# EAGLE schematic board (EAGLE 6.4)
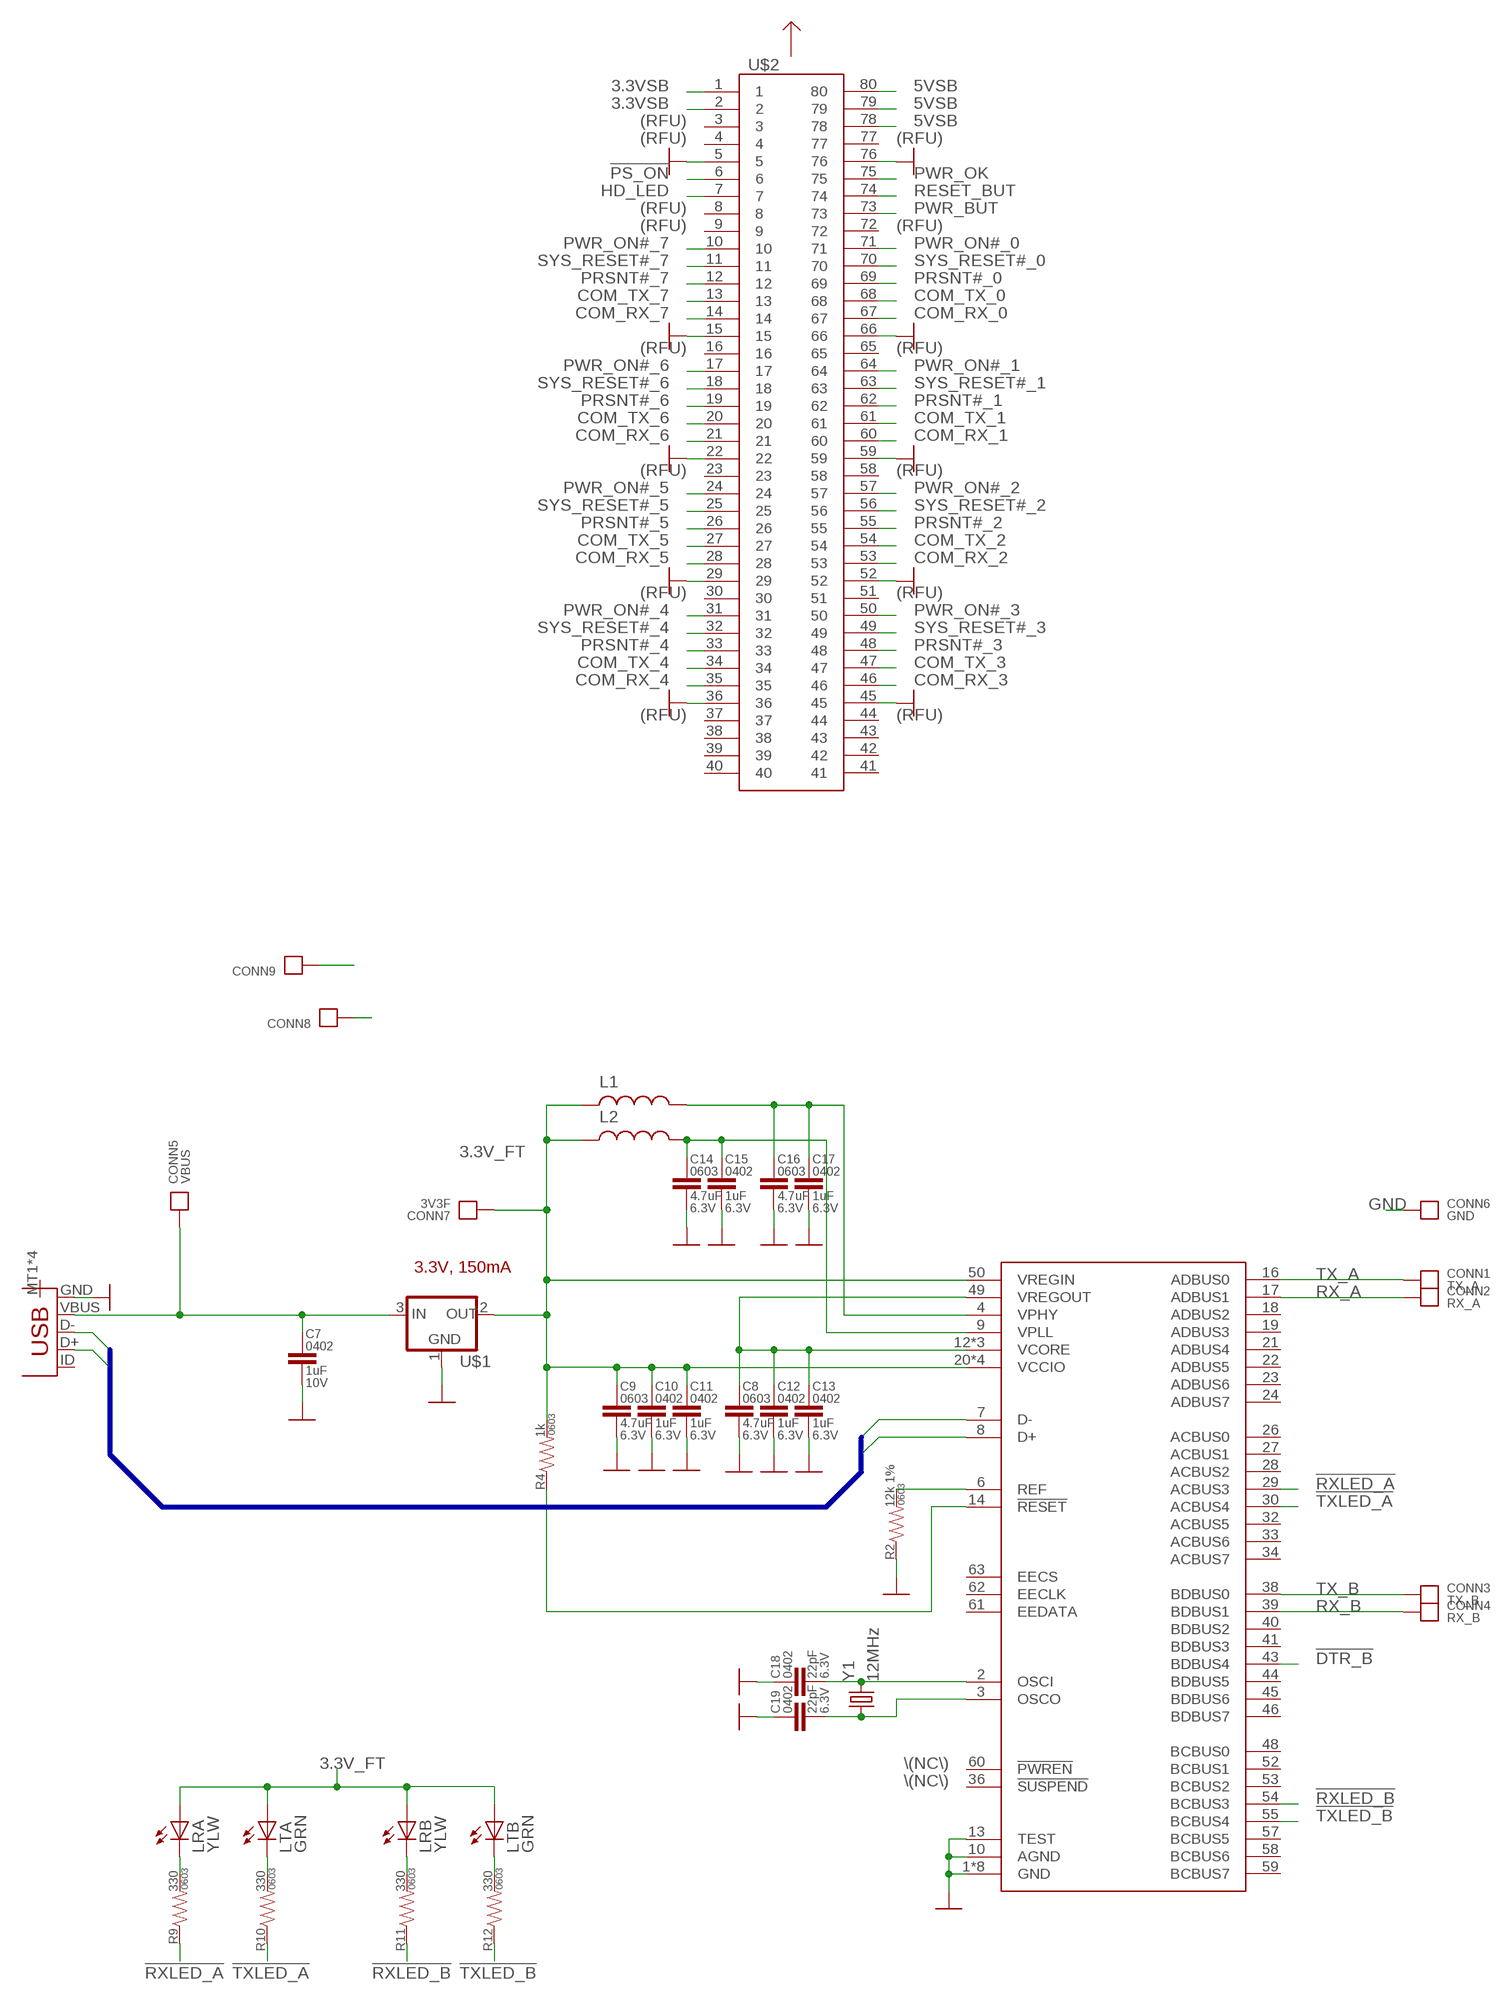
[diagram p0: schematic, sheet 1, part 1 of 2]
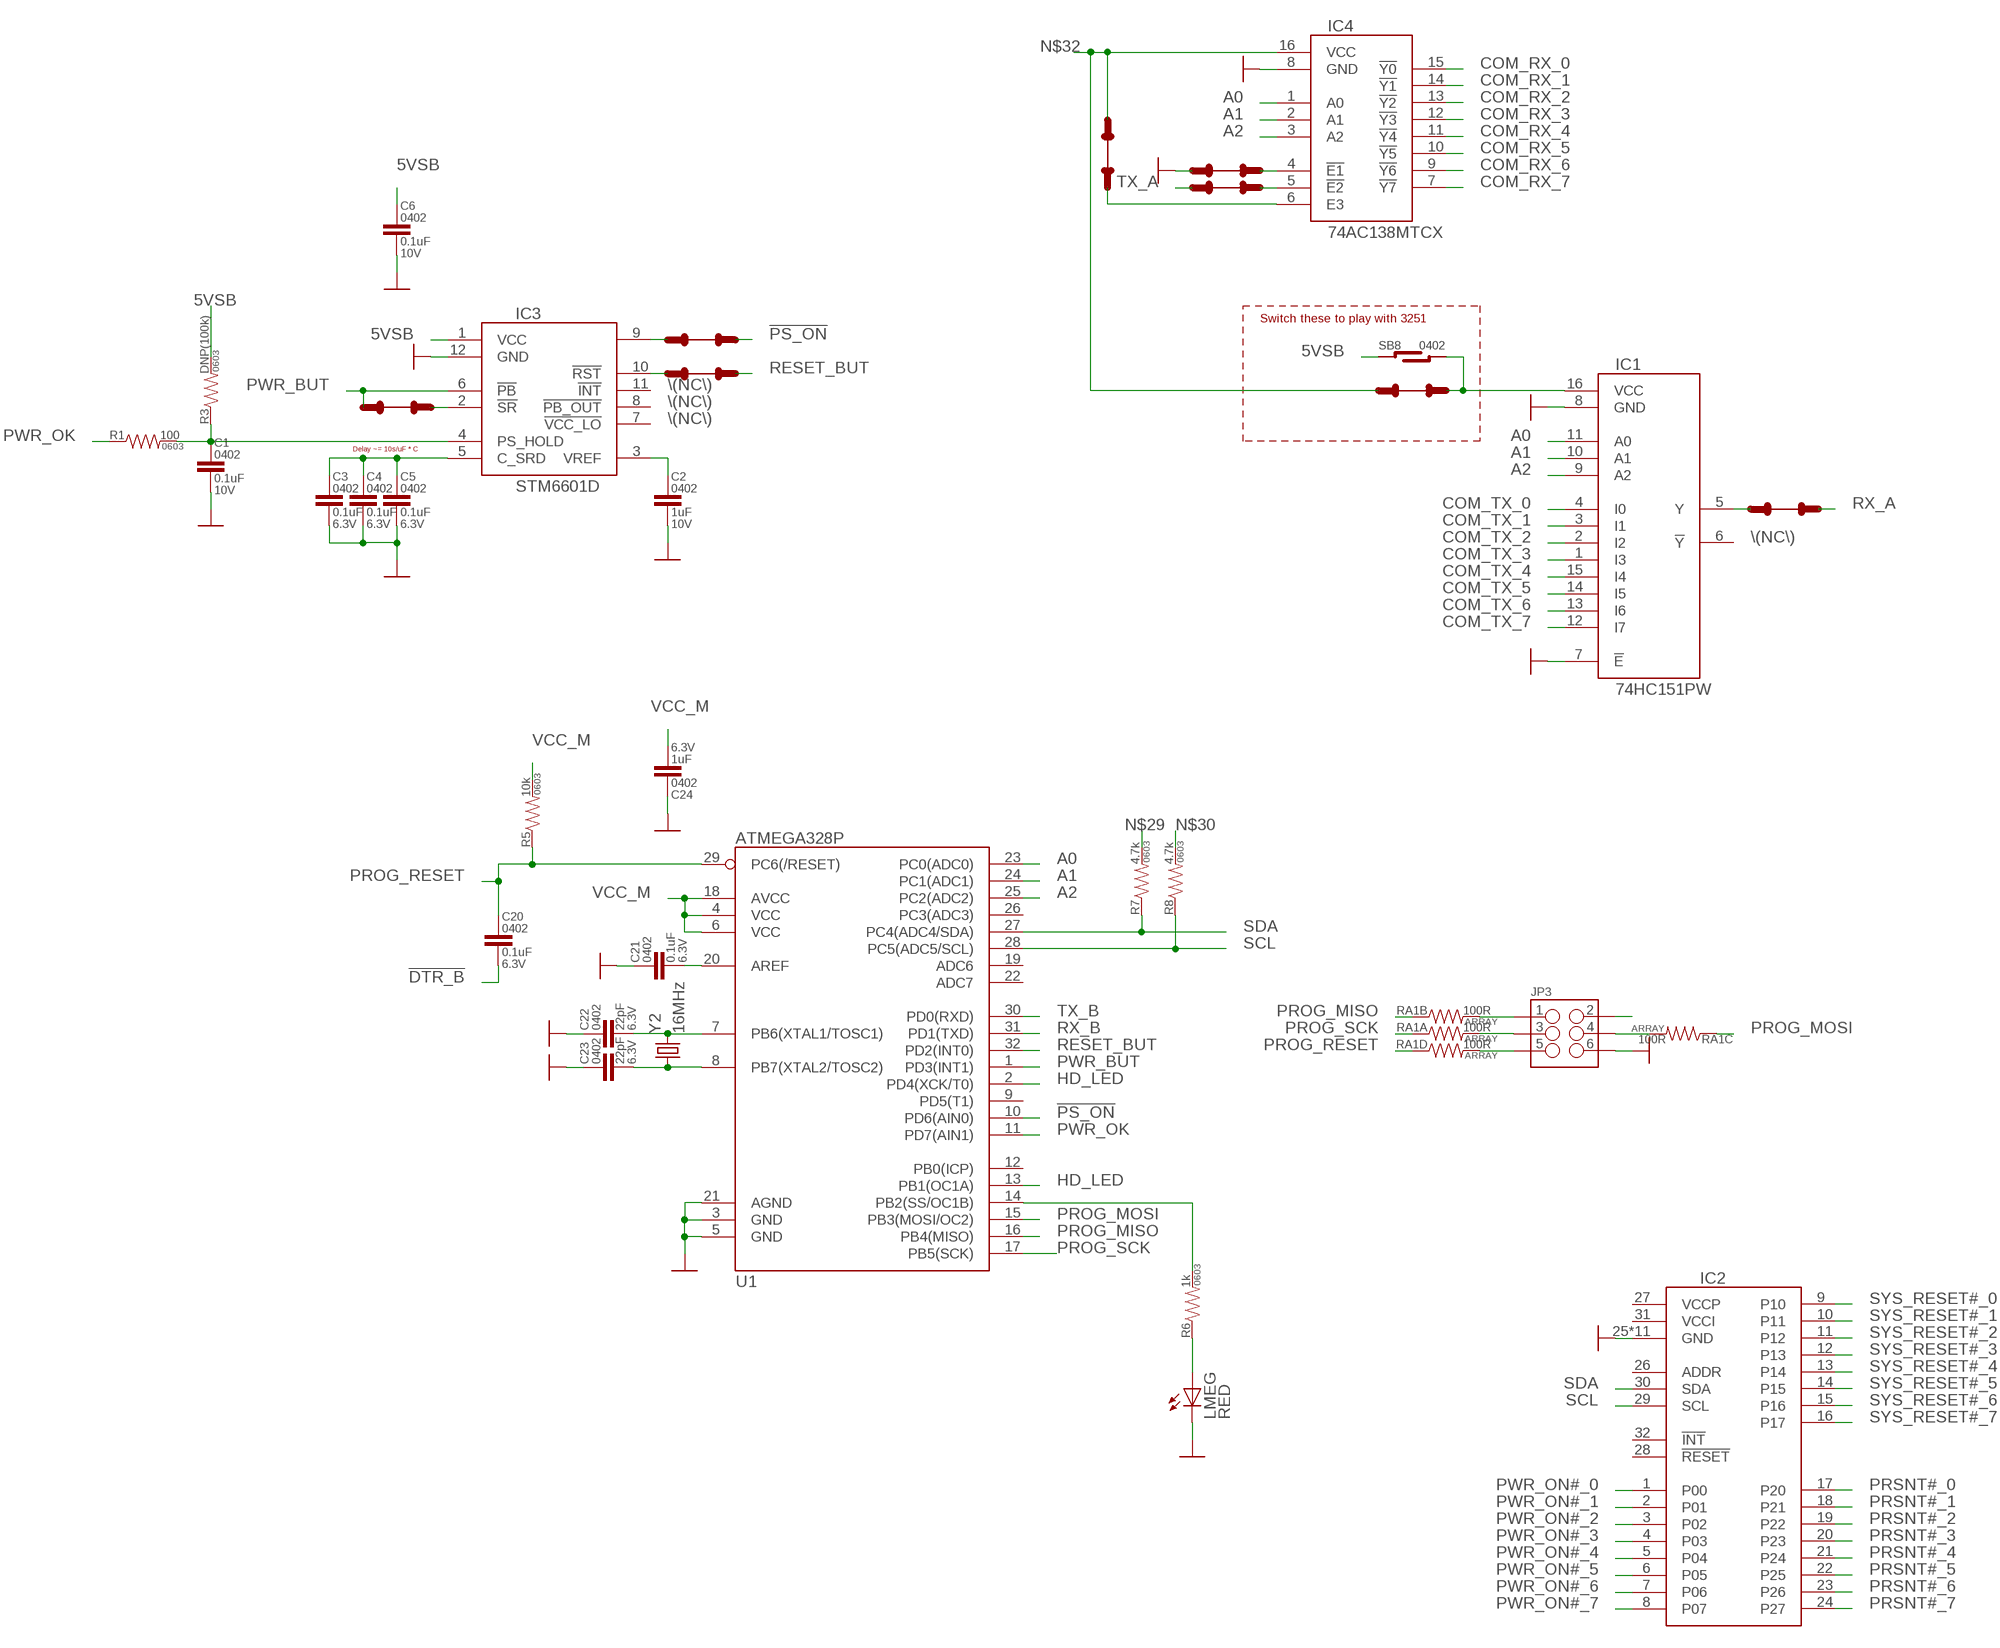
[diagram p1: schematic, sheet 1, part 2 of 2]

## Parts
C1  0.1uF  CAP0402-CAP  [0402-CAP]
C2  1uF  CAP0402-CAP  [0402-CAP]
C3  0.1uF  CAP0402-CAP  [0402-CAP]
C4  0.1uF  CAP0402-CAP  [0402-CAP]
C5  0.1uF  CAP0402-CAP  [0402-CAP]
C6  0.1uF  CAP0402-CAP  [0402-CAP]
C7  1uF  CAP0402-CAP  [0402-CAP]
C8  4.7uF  CAP0603  [0603-CAP]
C9  4.7uF  CAP0603  [0603-CAP]
C10  1uF  CAP0402-CAP  [0402-CAP]
C11  1uF  CAP0402-CAP  [0402-CAP]
C12  1uF  CAP0402-CAP  [0402-CAP]
C13  1uF  CAP0402-CAP  [0402-CAP]
C14  4.7uF  CAP0603  [0603-CAP]
C15  1uF  CAP0402-CAP  [0402-CAP]
C16  4.7uF  CAP0603  [0603-CAP]
C17  1uF  CAP0402-CAP  [0402-CAP]
C18  22pF  CAP0402-CAP  [0402-CAP]
C19  22pF  CAP0402-CAP  [0402-CAP]
C20  0.1uF  CAP0402-CAP  [0402-CAP]
C21  0.1uF  CAP0402-CAP  [0402-CAP]
C22  22pF  CAP0402-CAP  [0402-CAP]
C23  22pF  CAP0402-CAP  [0402-CAP]
C24  1uF  CAP0402-CAP  [0402-CAP]
CONN1  TX_A  CONNECTOR22AWG  [HOLE_22AWG]
CONN2  RX_A  CONNECTOR22AWG  [HOLE_22AWG]
CONN3  TX_B  CONNECTOR22AWG  [HOLE_22AWG]
CONN4  RX_B  CONNECTOR22AWG  [HOLE_22AWG]
CONN5  VBUS  CONNECTOR22AWG  [HOLE_22AWG]
CONN6  GND  CONNECTOR22AWG  [HOLE_22AWG]
CONN7  3V3F  CONNECTOR22AWG  [HOLE_22AWG]
CONN8  CONNECTOR22AWG  [HOLE_22AWG]
CONN9  CONNECTOR22AWG  [HOLE_22AWG]
IC1  74HC151PW  74151  [TSSOP16]
IC2  TCA6424A  [QFN32]
IC3  STM6601D  STM660{0,1}  [TDFN12]
IC4  74AC138MTCX  74138  [TSSOP16]
IC5  FT2232HL  [TQFP64_LONGPAD]
JP1  USB-IDMICRO  [USB-MICRO]
JP3  M03X2  [2X3_SMD]
L1  INDUCTOR0603  [0603]
L2  INDUCTOR0603  [0603]
LMEG  RED  LED0603  [0603_LED]
LRA  YLW  LED0603  [0603_LED]
LRB  YLW  LED0603  [0603_LED]
LTA  GRN  LED0603  [0603_LED]
LTB  GRN  LED0603  [0603_LED]
R1  100  RESISTOR0603  [0603-RES]
R2  12k 1%  RESISTOR0603  [0603-RES]
R3  DNP(100k)  RESISTOR0603  [0603-RES]
R4  1k  RESISTOR0603  [0603-RES]
R5  10k  RESISTOR0603  [0603-RES]
R6  1k  RESISTOR0603  [0603-RES]
R7  4.7k  RESISTOR0603  [0603-RES]
R8  4.7k  RESISTOR0603  [0603-RES]
R9  330  RESISTOR0603  [0603-RES]
R10  330  RESISTOR0603  [0603-RES]
R11  330  RESISTOR0603  [0603-RES]
R12  330  RESISTOR0603  [0603-RES]
RA1  100R  RESISTOR_ARRAY0603_X4  [0603-ARV]
SB1  TRACE-CUT  [TRACE-CUT]
SB2  TRACE-CUT  [TRACE-CUT]
SB3  TRACE-CUT  [TRACE-CUT]
SB4  TRACE-CUT  [TRACE-CUT]
SB5  TRACE-CUT  [TRACE-CUT]
SB6  TRACE-CUT  [TRACE-CUT]
SB7  TRACE-CUT  [TRACE-CUT]
SB8  SOLDER-BRIDGE0402  [SB-0402]
SB9  TRACE-CUT  [TRACE-CUT]
U1  ATMEGA328P  ATMEGA328_SMT  [TQFP32-08]
U$1  VREGSOT23-3  [SOT23-3]
U$2  DF40-80HDR  [DF40-HDR-80]
Y1  12MHz  CRYSTALSMD  [HC49UP]
Y2  16MHz  CRYSTALSMD  [HC49UP]

## Nets
3.3V_FT: C9.1 C10.1 C11.1 CONN7.P IC5.20(VCCIO) IC5.31(VCCIO) IC5.42(VCCIO) IC5.50(VREGIN) IC5.56(VCCIO) L1.1 L2.1 LRA.A LRB.A LTA.A LTB.A R4.2 U$1.2(OUT)
3.3VSB: U$2.1 U$2.2
5VSB: C6.1 IC3.1(VCC) R3.2 SB8.L1 SB8.L2 U$2.78 U$2.79 U$2.80
!DTR_B: C20.2 IC5.43(BDBUS4)
!PS_ON: SB1.R1 U1.10(PD6(AIN0)) U$2.6
!RXLED_A: IC5.29(ACBUS3) R9.1
!RXLED_B: IC5.54(BCBUS3) R11.1
!TXLED_A: IC5.30(ACBUS4) R10.1
!TXLED_B: IC5.55(BCBUS4) R12.1
A0: IC1.11(A0) IC4.1(A0) U1.23(PC0(ADC0))
A1: IC1.10(A1) IC4.2(A1) U1.24(PC1(ADC1))
A2: IC1.9(A2) IC4.3(A2) U1.25(PC2(ADC2))
COM_RX_0: IC4.15(!Y0) U$2.67
COM_RX_1: IC4.14(!Y1) U$2.60
COM_RX_2: IC4.13(!Y2) U$2.53
COM_RX_3: IC4.12(!Y3) U$2.46
COM_RX_4: IC4.11(!Y4) U$2.35
COM_RX_5: IC4.10(!Y5) U$2.28
COM_RX_6: IC4.9(!Y6) U$2.21
COM_RX_7: IC4.7(!Y7) U$2.14
COM_TX_0: IC1.4(I0) U$2.68
COM_TX_1: IC1.3(I1) U$2.61
COM_TX_2: IC1.2(I2) U$2.54
COM_TX_3: IC1.1(I3) U$2.47
COM_TX_4: IC1.15(I4) U$2.34
COM_TX_5: IC1.14(I5) U$2.27
COM_TX_6: IC1.13(I6) U$2.20
COM_TX_7: IC1.12(I7) U$2.13
D+: IC5.8(D+) JP1.D+
D-: IC5.7(D-) JP1.D-
GND: C1.2 C2.2 C3.2 C4.2 C5.2 C6.2 C7.2 C8.2 C9.2 C10.2 C11.2 C12.2 C13.2 C14.2 C15.2 C16.2 C17.2 C18.1 C19.1 C21.1 C22.1 C23.1 C24.1 CONN6.P IC1.7(!E) IC1.8(GND) IC2.25(GND) IC2.PAD1(GND) IC2.PAD2(GND) IC2.PAD3(GND) IC2.PAD4(GND) IC2.PAD5(GND) IC2.PAD6(GND) IC2.PAD7(GND) IC2.PAD8(GND) IC2.PAD9(GND) IC2.PAD(GND) IC3.12(GND) IC4.8(GND) IC5.1(GND) IC5.5(GND) IC5.10(AGND) IC5.11(GND) IC5.13(TEST) IC5.15(GND) IC5.25(GND) IC5.35(GND) IC5.47(GND) IC5.51(GND) JP1.GND JP3.6 LMEG.C R2.1 SB4.L1 U1.3(GND) U1.5(GND) U1.21(AGND) U$1.1(GND) U$2.5 U$2.15 U$2.22 U$2.29 U$2.36 U$2.45 U$2.52 U$2.59 U$2.66 U$2.76
HD_LED: U1.2(PD4(XCK/T0)) U1.13(PB1(OC1A)) U$2.7
N$1: IC3.10(!RST) SB3.L1
N$2: C1.1 IC3.4(PS_HOLD) R1.2 R3.1
N$3: IC3.9(EN/!EN) SB1.L1
N$4: C2.1 IC3.3(VREF)
N$5: C3.1 C4.1 C5.1 IC3.5(C_SRD)
N$6: IC3.2(!SR) SB2.R1
N$7: C7.1 CONN5.P JP1.VBUS U$1.3(IN)
N$8: C14.1 C15.1 IC5.9(VPLL) L2.2
N$9: IC5.6(REF) R2.2
N$10: C8.1 C12.1 C13.1 IC5.12(VCORE) IC5.37(VCORE) IC5.49(VREGOUT) IC5.64(VCORE)
N$11: C16.1 C17.1 IC5.4(VPHY) L1.2
N$12: JP3.2
N$13: IC5.14(!RESET) R4.1
N$14: C18.2 IC5.2(OSCI) Y1.2
N$15: C19.2 IC5.3(OSCO) Y1.1
N$16: C21.2 U1.20(AREF)
N$17: LRA.C R9.2
N$18: LTA.C R10.2
N$19: LRB.C R11.2
N$20: LTB.C R12.2
N$21: C22.2 U1.7(PB6(XTAL1/TOSC1)) Y2.2
N$22: C23.2 U1.8(PB7(XTAL2/TOSC2)) Y2.1
N$23: JP3.4 RA1.6
N$24: IC4.6(E3) SB5.L1
N$25: JP3.5 RA1.5
N$26: JP3.3 RA1.8
N$27: JP3.1 RA1.7
N$28: IC4.4(!E1) SB4.R1
N$29: R7.2
N$30: R8.2
N$31: CONN9.P
N$32: IC4.16(VCC) SB5.R1 SB9.L1
N$33: IC4.5(!E2) SB6.R1
N$34: IC1.5(Y) SB7.L1
N$35: CONN8.P
N$46: R6.2 U1.14(PB2(SS/OC1B))
N$55: LMEG.A R6.1
N$56: IC1.16(VCC) SB8.R1 SB8.R2 SB9.R1
PROG_MISO: RA1.2 U1.16(PB4(MISO))
PROG_MOSI: RA1.3 U1.15(PB3(MOSI/OC2))
PROG_RESET: C20.1 R5.1 RA1.4 U1.29(PC6(/RESET))
PROG_SCK: RA1.1 U1.17(PB5(SCK))
PRSNT#_0: IC2.17(P20) U$2.69
PRSNT#_1: IC2.18(P21) U$2.62
PRSNT#_2: IC2.19(P22) U$2.55
PRSNT#_3: IC2.20(P23) U$2.48
PRSNT#_4: IC2.21(P24) U$2.33
PRSNT#_5: IC2.22(P25) U$2.26
PRSNT#_6: IC2.23(P26) U$2.19
PRSNT#_7: IC2.24(P27) U$2.12
PWR_BUT: IC3.6(!PB) SB2.L1 U1.1(PD3(INT1)) U$2.73
PWR_OK: R1.1 U1.11(PD7(AIN1)) U$2.75
PWR_ON#_0: IC2.1(P00) U$2.71
PWR_ON#_1: IC2.2(P01) U$2.64
PWR_ON#_2: IC2.3(P02) U$2.57
PWR_ON#_3: IC2.4(P03) U$2.50
PWR_ON#_4: IC2.5(P04) U$2.31
PWR_ON#_5: IC2.6(P05) U$2.24
PWR_ON#_6: IC2.7(P06) U$2.17
PWR_ON#_7: IC2.8(P07) U$2.10
RESET_BUT: SB3.R1 U1.32(PD2(INT0)) U$2.74
RX_A: CONN2.P IC5.17(ADBUS1) SB7.R1
RX_B: CONN4.P IC5.39(BDBUS1) U1.31(PD1(TXD))
SCL: IC2.29(SCL) R8.1 U1.28(PC5(ADC5/SCL))
SDA: IC2.30(SDA) R7.1 U1.27(PC4(ADC4/SDA))
SYS_RESET#_0: IC2.9(P10) U$2.70
SYS_RESET#_1: IC2.10(P11) U$2.63
SYS_RESET#_2: IC2.11(P12) U$2.56
SYS_RESET#_3: IC2.12(P13) U$2.49
SYS_RESET#_4: IC2.13(P14) U$2.32
SYS_RESET#_5: IC2.14(P15) U$2.25
SYS_RESET#_6: IC2.15(P16) U$2.18
SYS_RESET#_7: IC2.16(P17) U$2.11
TX_A: CONN1.P IC5.16(ADBUS0) SB6.L1
TX_B: CONN3.P IC5.38(BDBUS0) U1.30(PD0(RXD))
VCC_M: C24.2 R5.2 U1.4(VCC) U1.6(VCC) U1.18(AVCC)
Unconnected: IC1.6(!Y) IC2.26(ADDR) IC2.27(VCCP) IC2.28(!RESET) IC2.31(VCCI) IC2.32(!INT) IC3.7(!VCC_LO) IC3.8(!PB_OUT) IC3.11(!INT) IC5.18(ADBUS2) IC5.19(ADBUS3) IC5.21(ADBUS4) IC5.22(ADBUS5) IC5.23(ADBUS6) IC5.24(ADBUS7) IC5.26(ACBUS0) IC5.27(ACBUS1) IC5.28(ACBUS2) IC5.32(ACBUS5) IC5.33(ACBUS6) IC5.34(ACBUS7) IC5.36(!SUSPEND) IC5.40(BDBUS2) IC5.41(BDBUS3) IC5.44(BDBUS5) IC5.45(BDBUS6) IC5.46(BDBUS7) IC5.48(BCBUS0) IC5.52(BCBUS1) IC5.53(BCBUS2) IC5.57(BCBUS5) IC5.58(BCBUS6) IC5.59(BCBUS7) IC5.60(!PWREN) IC5.61(EEDATA) IC5.62(EECLK) IC5.63(EECS) JP1.ID JP1.MT1(SHELL) JP1.MT2(SHELL) JP1.P$1(SHELL) JP1.P$2(SHELL) U1.9(PD5(T1)) U1.12(PB0(ICP)) U1.19(ADC6) U1.22(ADC7) U1.26(PC3(ADC3)) U$2.3 U$2.4 U$2.8 U$2.9 U$2.16 U$2.23 U$2.30 U$2.37 U$2.38 U$2.39 U$2.40 U$2.41 U$2.42 U$2.43 U$2.44 U$2.51 U$2.58 U$2.65 U$2.72 U$2.77

## Buses
D-,D+

## Notes on the sheet
- (RFU)
- (RFU) | (RFU)
- (RFU)
- (RFU) | (RFU)
- (RFU) | (RFU)
- (RFU) | (RFU)
- (RFU) | (RFU)
- Switch these to play with 3251
- (RFU) | (RFU) | \(NC\)
- \(NC\)
- \(NC\)
- Delay ~= 10s/uF * C
- \(NC\)
- 3.3V, 150mA
- \(NC\)
- \(NC\)

## Library data of the parts
C1 C2 C6 C7 = kmod-passives:CAP: Capacitor Standard 0603 ceramic capacitor, and 0.1" leaded capacitor.; PACKAGE: 0402; VOLTAGE: 10V
C3-C5 C10-C13 C15 C17-C24 = kmod-passives:CAP: Capacitor Standard 0603 ceramic capacitor, and 0.1" leaded capacitor.; PACKAGE: 0402; VOLTAGE: 6.3V
C8 C9 C14 C16 = kmod-passives:CAP: Capacitor Standard 0603 ceramic capacitor, and 0.1" leaded capacitor.; PACKAGE: 0603; VOLTAGE: 6.3V
CONN1-CONN9 = kmod-nonparts:CONNECTOR: Collection of holes/pads for testing/connecting
IC1 = kmod-ics:74*151: 8-to-1 multiplexer I believe this is compatible with 74*251 and 74*3251 parts as well, though the behavior of those parts are slightly different. (251 has tri-stated outputs if not enabled, and the 3251 is an analog switch.) Note that 3251 parts often come in slightl different packages: 3.9mm-width with 0.635mm pitch (vs 4.4mm-width and 0.65mm pitch).
IC2 = kmod-testing:TCA6424A: 24-Bit I2C IO expander http://www.ti.com/lit/ds/symlink/tca6424a.pdf http://www.digikey.com/product-detail/en/TCA6424ARGJR/296-27844-1-ND/2411683
IC3 = kmod-testing:STM660{0,1}; EN: !EN
IC4 = kmod-ics:74*138: 3-to-8 decoder/demultiplexer; inverting Such as http://www.nxp.com/documents/data_sheet/74HC_HCT138.pdf
IC5 = kmod-ics:FT2232H
JP1 = kmod-connectors:USB-ID: USB Connectors Got from SparkFun, removed all but MICROB. Used that successfully. no mounting holes - I think this footprint will work for micro-A/B/AB connectors. haven't tested it yet on anything other than B.; PROD_ID: CONN-09505
JP3 = SparkFun-Connectors:M03X2: 2x3 .1" header. Shrouded, with keying- CONN-10681 SMT- CONN-11415 Pogo pins- HW-11044; PROD_ID: CONN-11290
L1 L2 = kmod-passives:INDUCTOR
LMEG LRA LRB LTA LTB = kmod-passives:LED
R1-R12 = kmod-passives:RESISTOR: Resistor Basic schematic elements and footprints for 0603, 1206, and PTH resistors.; PACKAGE: 0603
RA1 = kmod-passives:RESISTOR_ARRAY; PACKAGE: ARRAY
SB1-SB7 SB9 = kmod-nonparts:TRACE-CUT
SB8 = kmod-nonparts:SOLDER-BRIDGE; PACKAGE: 0402
U1 = SparkFun-DigitalIC:ATMEGA328_SMT: 32-Pin Atmega328 part Commonly used on Arduino compatible boards Available in QFP and QFN packages TQFP is IC-09069 QFN is non-stock; PROD_ID: IC-09069
U$1 = kmod-ics:VREG
U$2 = kmod-connectors:DF40-80
Y1 Y2 = SparkFun-FreqCtrl:CRYSTAL: Various standard crystals. Proven footprints. Spark Fun Electronics SKU : COM-00534